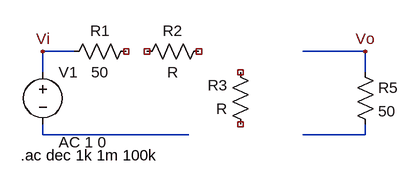
[diagram p0: schematic ej2.asc]
ej2.asc, the LTspice schematic file:
Version 4
SHEET 1 880 680
WIRE 48 64 0 64
WIRE 496 64 400 64
WIRE 0 96 0 64
WIRE 496 96 496 64
WIRE 0 192 0 176
WIRE 224 192 0 192
WIRE 496 192 496 176
WIRE 496 192 400 192
FLAG 496 64 Vo
FLAG 0 64 Vi
SYMBOL voltage 0 80 R0
WINDOW 123 24 124 Left 2
WINDOW 39 0 0 Left 0
SYMATTR InstName V1
SYMATTR Value ""
SYMATTR Value2 AC 1 0
SYMBOL res 144 48 R90
WINDOW 0 0 56 VBottom 2
WINDOW 3 32 56 VTop 2
SYMATTR InstName R1
SYMATTR Value 50
SYMBOL res 480 80 R0
SYMATTR InstName R5
SYMATTR Value 50
SYMBOL res 256 48 R90
WINDOW 0 0 56 VBottom 2
WINDOW 3 32 56 VTop 2
SYMATTR InstName R2
SYMBOL res 320 192 R180
WINDOW 0 36 76 Left 2
WINDOW 3 36 40 Left 2
SYMATTR InstName R3
TEXT -34 224 Left 2 !.ac dec 1k 1m 100k

The netlist it stands for:
* ej2.asc
V1 Vi N001 AC 1 0
R1 NC_01 Vi 50
R5 Vo N002 50
R2 NC_02 NC_03 R
R3 NC_04 NC_05 R
.ac dec 1k 1m 100k
.backanno
.end